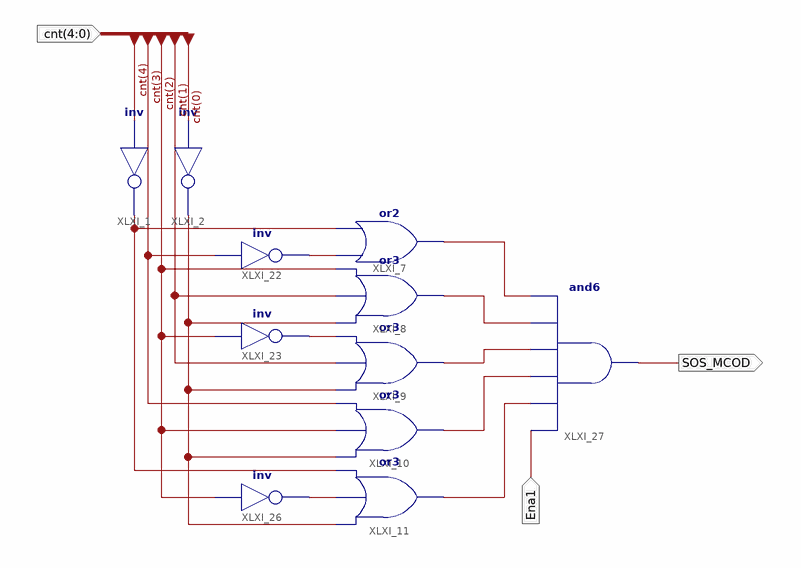
[diagram p0: schematic sheet 1]
// Xilinx ISE schematic SOS_MC.sch (spartan6) as structural Verilog: 11 symbols, 3 ports
module SOS_MC (
  input  [4:0] cnt,
  input  Ena1,
  output SOS_MCOD
);

  wire XLXN_12, XLXN_13, XLXN_21, XLXN_22, XLXN_25, XLXN_26, XLXN_27, XLXN_28, XLXN_29, XLXN_31;

  not XLXI_2 (XLXN_13, cnt[0]);
  not XLXI_1 (XLXN_12, cnt[4]);
  or XLXI_7 (XLXN_26, XLXN_21, XLXN_12);
  or XLXI_8 (XLXN_27, XLXN_13, cnt[1], cnt[2]);
  or XLXI_9 (XLXN_28, XLXN_13, cnt[1], XLXN_22);
  or XLXI_10 (XLXN_29, XLXN_13, cnt[2], cnt[3]);
  or XLXI_11 (XLXN_31, XLXN_13, XLXN_25, XLXN_12);
  not XLXI_22 (XLXN_21, cnt[3]);
  not XLXI_23 (XLXN_22, cnt[2]);
  not XLXI_26 (XLXN_25, cnt[2]);
  and XLXI_27 (SOS_MCOD, Ena1, XLXN_31, XLXN_29, XLXN_28, XLXN_27, XLXN_26);
endmodule
